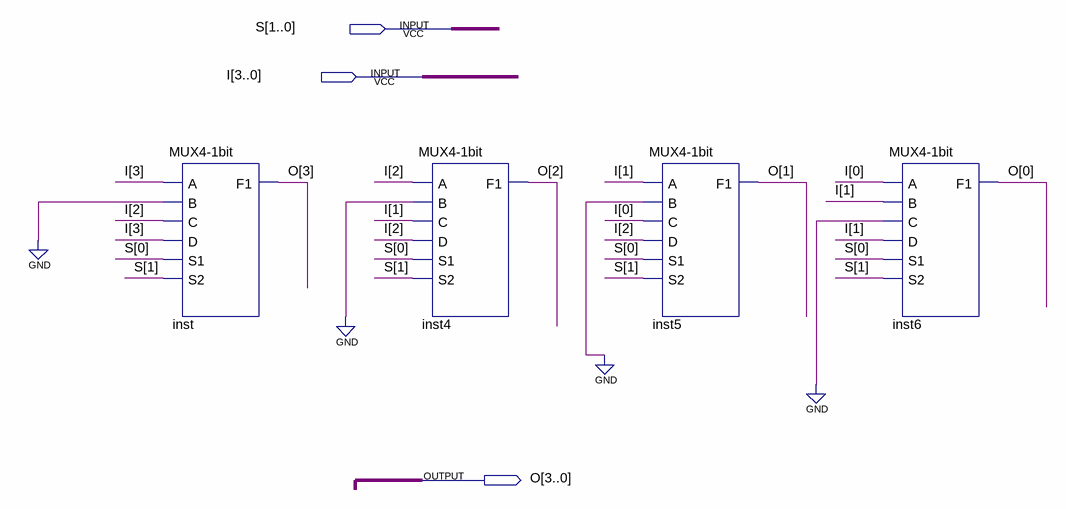
[diagram p0: schematic sheet]
// Quartus schematic 4_BIT_SHIFT.bdf as structural Verilog: 4 symbols, 3 pins
module \4_BIT_SHIFT  (
  input  [1:0] S,
  input  [3:0] I,
  output [3:0] O
);

  \MUX4-1bit  inst (.A(I[3]), .B(1'b0), .C(I[2]), .D(I[3]), .S1(S[0]), .S2(S[1]), .F1(O[3]));
  \MUX4-1bit  inst4 (.A(I[2]), .B(1'b0), .C(I[1]), .D(I[2]), .S1(S[0]), .S2(S[1]), .F1(O[2]));
  \MUX4-1bit  inst5 (.A(I[1]), .B(1'b0), .C(I[0]), .D(I[2]), .S1(S[0]), .S2(S[1]), .F1(O[1]));
  \MUX4-1bit  inst6 (.A(I[0]), .B(I[1]), .C(1'b0), .D(I[1]), .S1(S[0]), .S2(S[1]), .F1(O[0]));
endmodule
